# Altium project Main Board.PrjPCB (part 1 of 2)
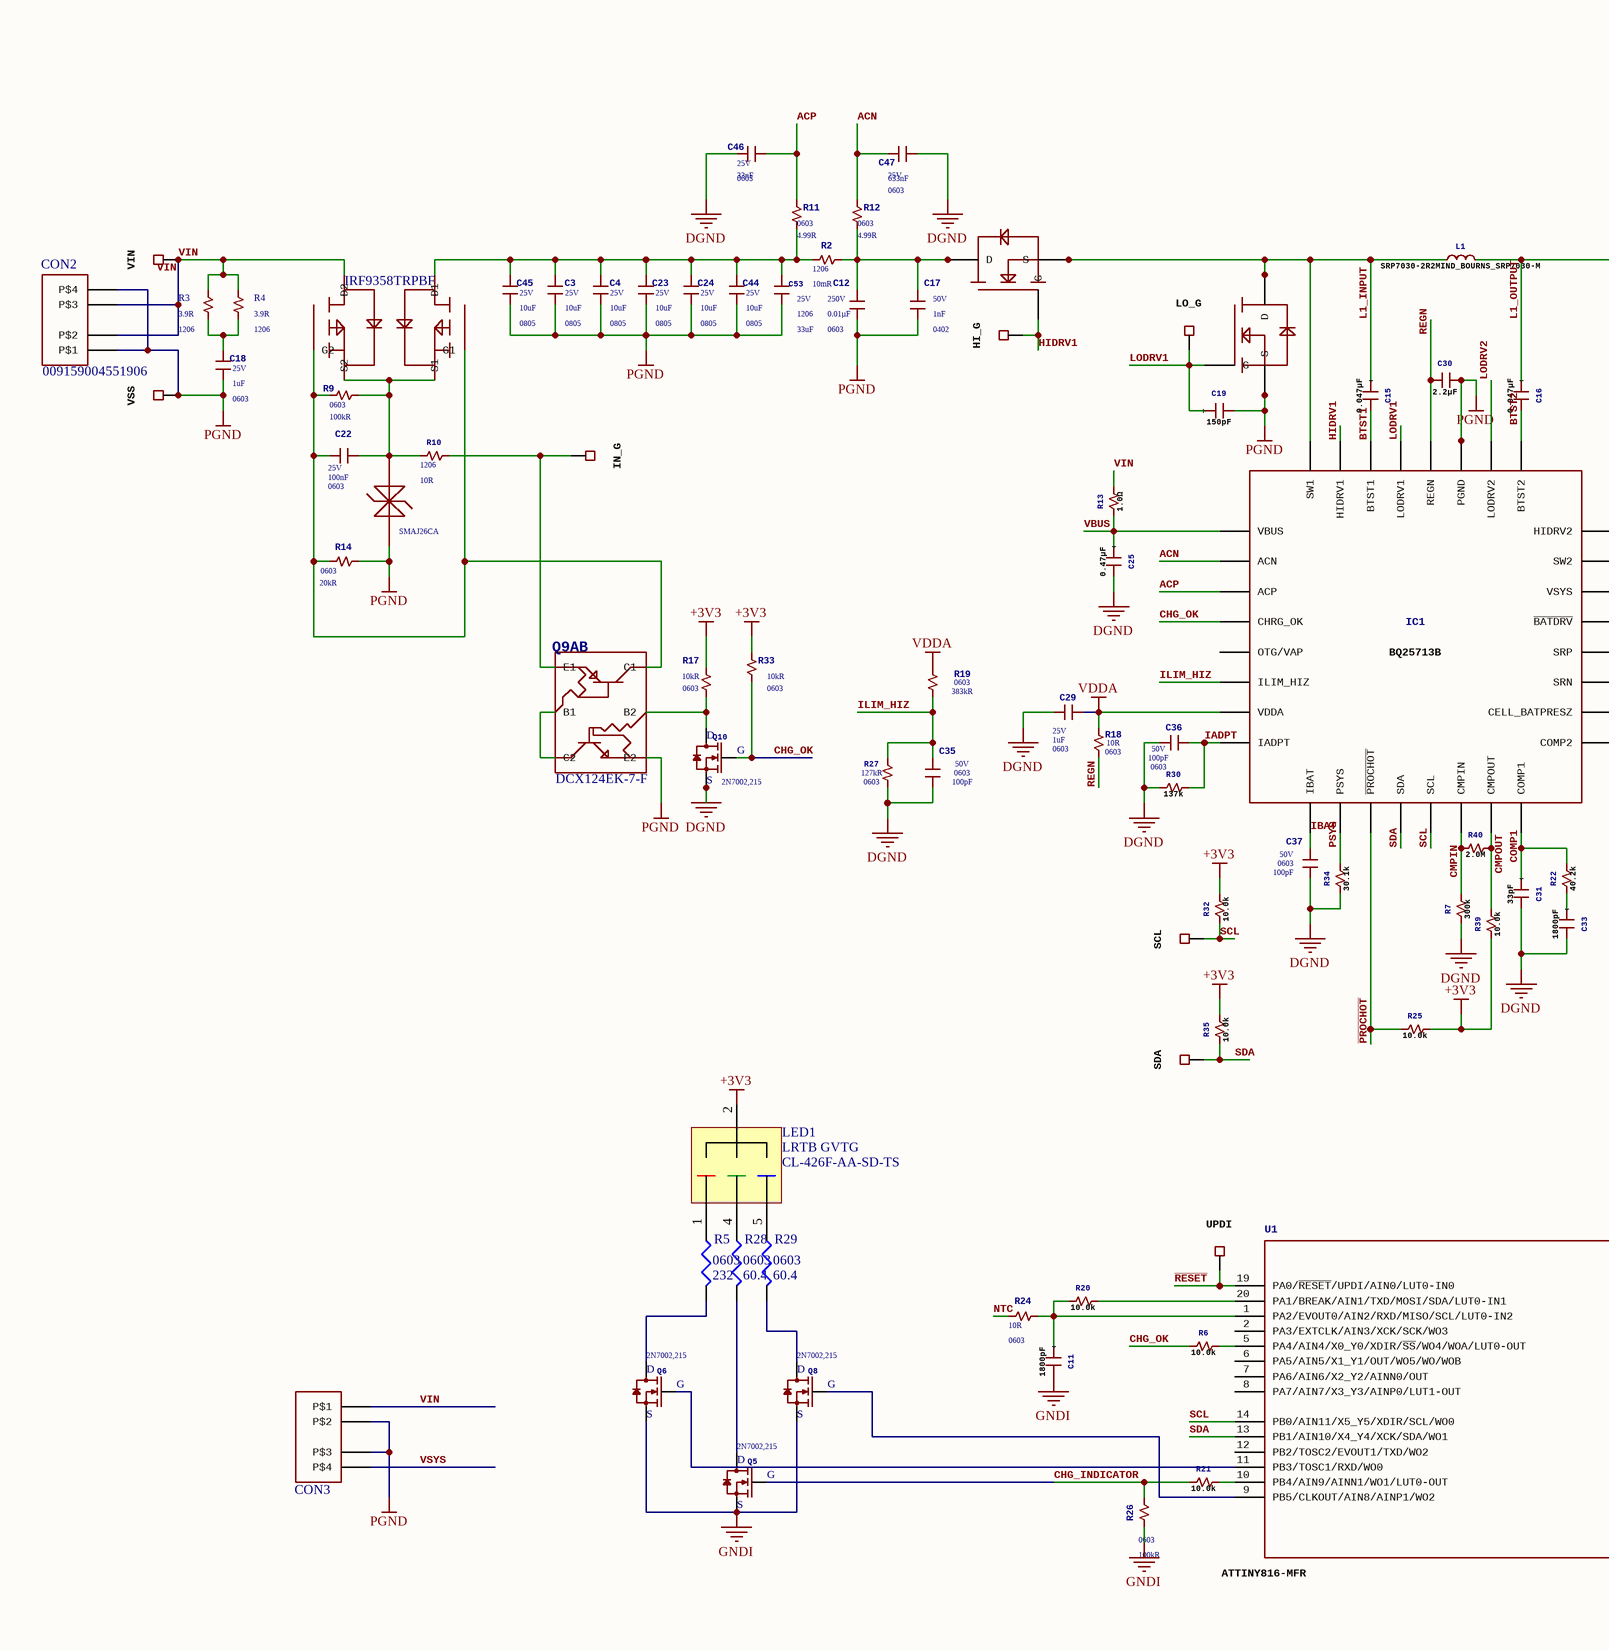
[diagram p0: Main Board.SchDoc, left]
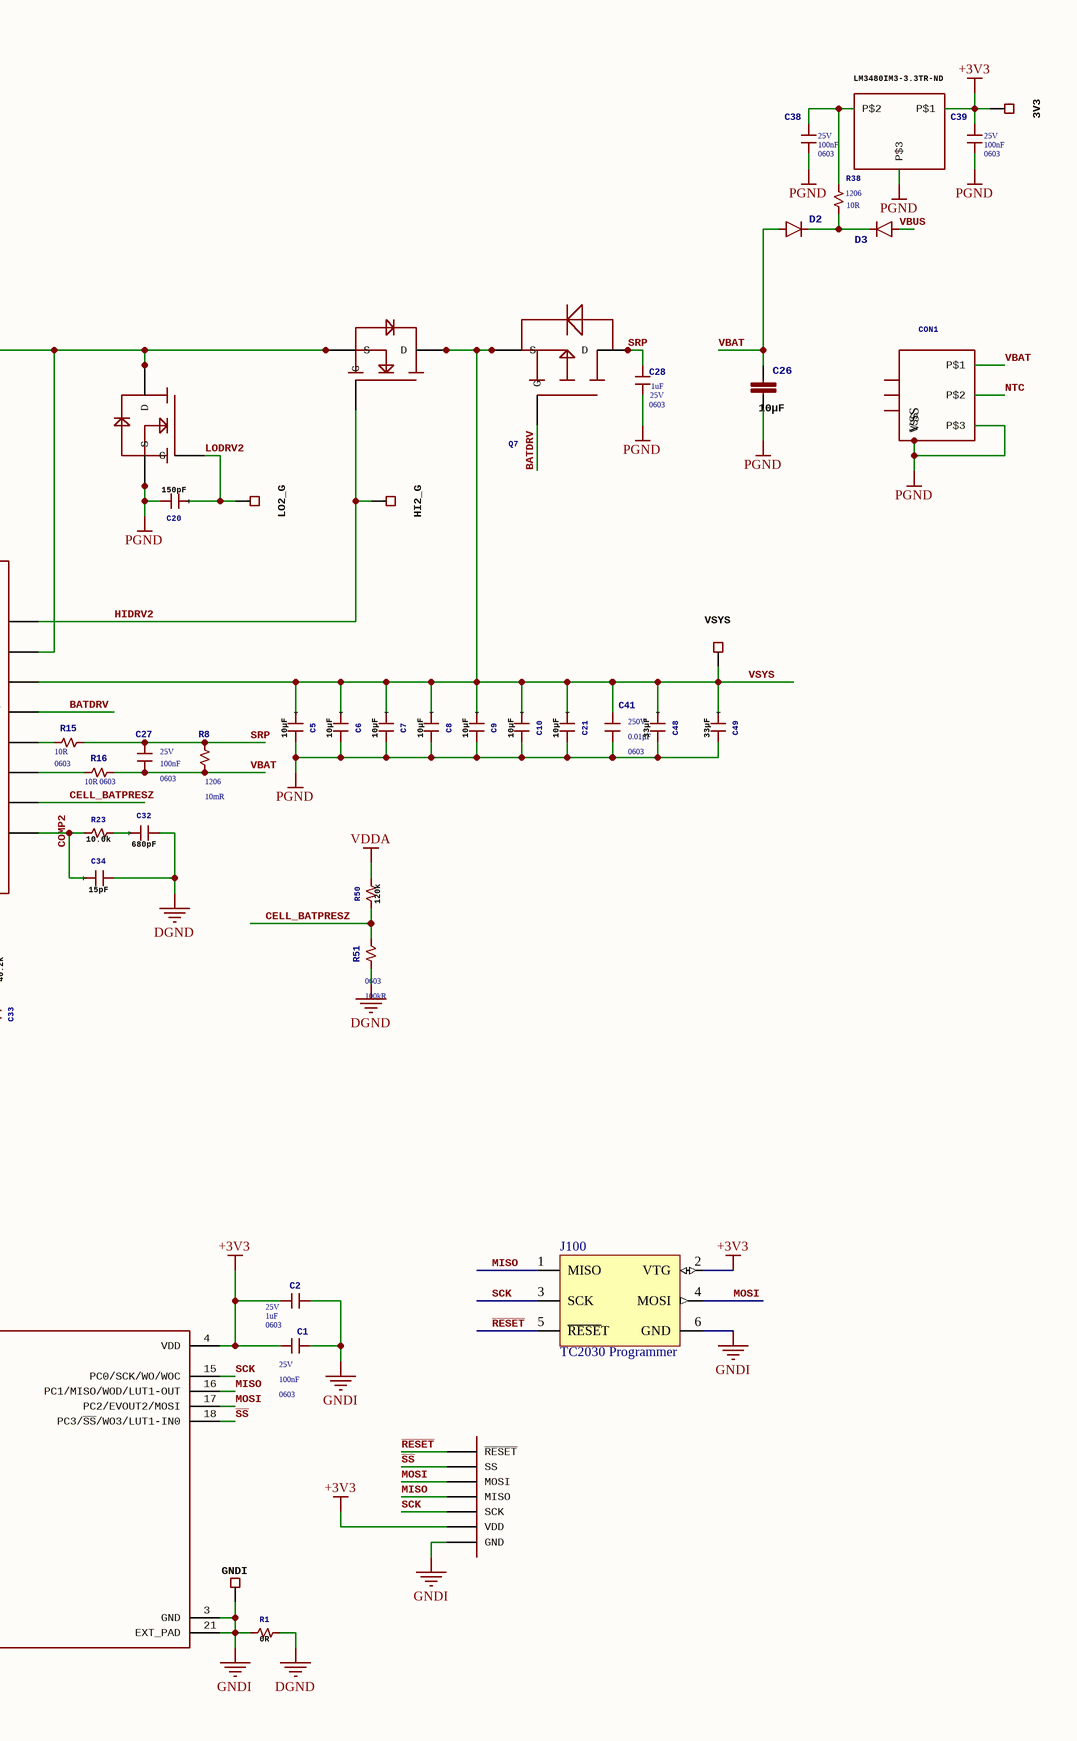
[diagram p1: Main Board.SchDoc, right]
1 sheet, 121 parts. Net scope: global (net labels, ports and power ports of the same name join across sheets).
Board file: Main Board.PcbDoc

## Sheet Main Board.SchDoc
size 456 x 312 mm

### Parts
C1  Voltage Rating: 25V  Capacitance: 100nF  [0603]  (hidden comment: CAP CER 0.1UF 25V X7R 0603)
C2  Voltage: 25V  Capacitance: 1uF  [0603]  (hidden comment: CAP CER 1UF 25V X7R 0603)
C3  Voltage Rating: 25V  Capacitance: 10uF  [0805]  (hidden comment: CAP CER 10UF 25V X5R 0805)
C4  Voltage Rating: 25V  Capacitance: 10uF  [0805]  (hidden comment: CAP CER 10UF 25V X5R 0805)
C5  10µF  [0805]
C6  10µF  [0805]
C7  10µF  [0805]
C8  10µF  [0805]
C9  10µF  [0805]
C10  10µF  [0805]
C11  1800pF  [0402]
C12  Voltage: 250V  Capacitance: 0.01µF  [0603]  (hidden comment: CAP CER 0.01UF 250V X7R 0603)
C15  0.047µF  [0603]
C16  0.047µF  [0603]
C17  Voltage Rating: 50V  Capacitance: 1nF  [0402]  (hidden comment: CAP CER 1000PF 50V C0G/NP0 0402)
C18  Voltage: 25V  Capacitance: 1uF  [0603]  (hidden comment: CAP CER 1UF 25V X7R 0603)
C19  150pF  [0603]
C20  150pF  [0603]
C21  10µF  [0805]
C22  Voltage Rating: 25V  Capacitance: 100nF  [0603]  (hidden comment: CAP CER 0.1UF 25V X7R 0603)
C23  Voltage Rating: 25V  Capacitance: 10uF  [0805]  (hidden comment: CAP CER 10UF 25V X5R 0805)
C24  Voltage Rating: 25V  Capacitance: 10uF  [0805]  (hidden comment: CAP CER 10UF 25V X5R 0805)
C25  0.47µF  [0805]
C26  10µF  [C1206]
C27  Voltage Rating: 25V  Capacitance: 100nF  [0603]  (hidden comment: CAP CER 0.1UF 25V X7R 0603)
C28  Voltage: 25V  Capacitance: 1uF  [0603]  (hidden comment: CAP CER 1UF 25V X7R 0603)
C29  Voltage: 25V  Capacitance: 1uF  [0603]  (hidden comment: CAP CER 1UF 25V X7R 0603)
C30  2.2µF  [0603]
C31  33pF  [0402]
C32  680pF  [0402]
C33  1800pF  [0402]
C34  15pF  [0402]
C35  Voltage: 50V  Capacitance: 100pF  [0603]  (hidden comment: CAP CER 100PF 50V C0G/NP0 0603)
C36  Voltage: 50V  Capacitance: 100pF  [0603]  (hidden comment: CAP CER 100PF 50V C0G/NP0 0603)
C37  Voltage: 50V  Capacitance: 100pF  [0603]  (hidden comment: CAP CER 100PF 50V C0G/NP0 0603)
C38  Voltage Rating: 25V  Capacitance: 100nF  [0603]  (hidden comment: CAP CER 0.1UF 25V X7R 0603)
C39  Voltage Rating: 25V  Capacitance: 100nF  [0603]  (hidden comment: CAP CER 0.1UF 25V X7R 0603)
C41  Voltage: 250V  Capacitance: 0.01µF  [0603]  (hidden comment: CAP CER 0.01UF 250V X7R 0603)
C44  Voltage Rating: 25V  Capacitance: 10uF  [0805]  (hidden comment: CAP CER 10UF 25V X5R 0805)
C45  Voltage Rating: 25V  Capacitance: 10uF  [0805]  (hidden comment: CAP CER 10UF 25V X5R 0805)
C46  Voltage Rating: 25V  Capacitance: 33nF  [0603]  (hidden comment: CAP CER 0.033UF 25V X7R 0603)
C47  Voltage Rating: 25V  Capacitance: 633nF  [0603]  (hidden comment: CAP CER 0.033UF 25V X7R 0603)
C48  33µF  [1206]
C49  33µF  [1206]
C53  Voltage Rating: 25V  Capacitance: 33uF  [1206]  (hidden comment: CAP CER 33UF 25V X5R 1206)
CON1  BM03B-ADHKS-GAN-ETB  [BM03B-ADHKS-GAN-ETB]  (value not drawn)
CON2  009159004551906  [AVX-9159-4-PIN-EDGE]
CON3  AVX-9159-4-PIN-CARD-EDGE  [AVX-9159-4-PIN-EDGE]  (value not drawn)
D1  TVS DIODE 26V 42.1V DO214AC  [DO-214AC]  (value not drawn)
D2  DIODE-SOD323-R  [SOD323-R]  (value not drawn)
D3  DIODE-SOD323-R  [SOD323-R]  (value not drawn)
IC1  BQ25713B  [S-PWQFN-N32]
J100  TC2030 Programmer  [TC2030]  (no BOM)
L1  SRP7030-2R2MIND_BOURNS_SRP7030-M  [IND_BOURNS_SRP7030-M]
LED1  LRTB GVTG  [CL-426F-AA-SD-TS]
PAD1  3V3  [PAD]
PAD2  VIN  [PAD]
PAD3  VSS  [PAD]
PAD4  UPDI  [PAD]
PAD5  SCL  [PAD]
PAD6  SDA  [PAD]
PAD7  VSYS  [PAD]
PAD10  GNDI  [PAD]
PAD11  LO2_G  [PAD]
PAD12  IN_G  [PAD]
PAD13  HI_G  [PAD]
PAD14  LO_G  [PAD]
PAD15  HI2_G  [PAD]
Q1  CSD17551Q3A  [TI-Q3A]  (value not drawn)
Q2  CSD17551Q3A  [TI-Q3A]  (value not drawn)
Q3  CSD17551Q3A  [TI-Q3A]  (value not drawn)
Q4  CSD17551Q3A  [TI-Q3A]  (value not drawn)
Q5  2N7002,215  [SOT-23]
Q5-6  MOSFET 2P-CH 30V 9.2A 8SOIC  [INFENION_SO8]  (value not drawn)
Q6  2N7002,215  [SOT-23]
Q7  CSD25402Q3A  [TI-Q3A]  (value not drawn)
Q8  2N7002,215  [SOT-23]
Q9AB  DCX124EK-7-F  [SC-74R]
Q10  2N7002,215  [SOT-23]
R1  0R  [0402]
R2  Resistance: 10mR  [1206]  (hidden comment: RES 0.01 OHM 1% 1W 1206)
R3  Resistance: 3.9R  [1206]  (hidden comment: RES 3.9 OHM 5% 1/4W 1206)
R4  Resistance: 3.9R  [1206]  (hidden comment: RES 3.9 OHM 5% 1/4W 1206)
R5  Resistance (Ohms): 232  [0603]  (hidden comment: RC0603FR-07232RL)
R6  10.0k  [0402]
R7  300k  [0603]
R8  Resistance: 10mR  [1206]  (hidden comment: RES 0.01 OHM 1% 1W 1206)
R9  Resistance: 100kR  [0603]  (hidden comment: RES SMD 100K OHM 1% 1/10W 0603)
R10  Resistance: 10R  [1206]  (hidden comment: RES SMD 10 OHM 1% 1/2W 1206)
R11  Resistance: 4.99R  [0603]  (hidden comment: RES 4.99 OHM 1% 1/10W 0603)
R12  Resistance: 4.99R  [0603]  (hidden comment: RES 4.99 OHM 1% 1/10W 0603)
R13  1.0Ω  [0805]
R14  Resistance: 20kR  [0603]  (hidden comment: RES 20K OHM 5% 1/10W 0603)
R15  Resistance: 10R  [0603]  (hidden comment: RES SMD 10 OHM 1% 1/10W 0603)
R16  Resistance: 10R  [0603]  (hidden comment: RES SMD 10 OHM 1% 1/10W 0603)
R17  Resistance: 10kR  Case/Package: 0603  [0402]  (hidden comment: RES SMD 10K OHM 1% 1/10W 0603)
R18  Resistance: 10R  [0603]  (hidden comment: RES SMD 10 OHM 1% 1/10W 0603)
R19  Resistance: 383kR  [0603]  (hidden comment: RES SMD 383K OHM 1% 1/10W 0603)
R20  10.0k  [0402]
R21  10.0k  [0402]
R22  40.2k  [0402]
R23  10.0k  [0402]
R24  Resistance: 10R  [0603]  (hidden comment: RES SMD 10 OHM 1% 1/10W 0603)
R25  10.0k  [0603]
R26  Resistance: 100kR  [0603]  (hidden comment: RES SMD 100K OHM 1% 1/10W 0603)
R27  Resistance: 127kR  [0603]  (hidden comment: RES SMD 127K OHM 1% 1/10W 0603)
R28  Resistance (Ohms): 60.4  [0603]  (hidden comment: RC0603FR-0760R4L)
R29  Resistance (Ohms): 60.4  [0603]  (hidden comment: RC0603FR-0760R4L)
R30  137k  [0603]
R32  10.0k  [0603]
R33  Resistance: 10kR  Case/Package: 0603  [0402]  (hidden comment: RES SMD 10K OHM 1% 1/10W 0603)
R34  30.1k  [0603]
R35  10.0k  [0603]
R38  Resistance: 10R  [1206]  (hidden comment: RES SMD 10 OHM 1% 1/2W 1206)
R39  10.0k  [0603]
R40  2.0M  [0603]
R50  120k  [0603]
R51  Resistance: 100kR  [0603]  (hidden comment: RES SMD 100K OHM 1% 1/10W 0603)
U1  ATTINY816-MFR  [QFN40P300X300X90-21N]
U2  LM3480IM3-3.3TR-ND  [SOT-23_2]
U$1  ATTINY_DEBUG  [ATTINY_DEBUG]  (value not drawn)

### Nets
+3V3: C1.P$1 C2.P$2 C39.P$2 J100.2(VTG) LED1.2 PAD1.P$1 R17.P$2 R25.P$2 R32.P$2 R33.P$2 R35.P$2 R39.P$1 U1.4(VDD) U2.P$1 U$1.P$2(VDD)
DGND: C25.P$2 C29.P$1 C31.P$2 C32.P$2 C33.P$2 C34.P$2 C35.P$1 C36.P$1 C37.P$1 C46.P$1 C47.P$2 Q10.2(S) R1.P$2 R7.P$1 R27.P$1 R30.P$1 R34.P$1 R51.P$1
GNDI: C1.P$2 C2.P$1 C11.P$2 J100.6(GND) PAD10.P$1 Q5.2(S) Q6.2(S) Q8.2(S) R1.P$1 R26.P$1 U1.3(GND) U1.21(EXT_PAD) U$1.P$1(GND)
PGND: C3.P$1 C4.P$1 C5.P$2 C6.P$2 C7.P$2 C8.P$2 C9.P$2 C10.P$2 C12.P$1 C17.P$1 C18.P$1 C19.P$2 C20.P$2 C21.P$2 C23.P$1 C24.P$1 C26.2 C28.P$1 C30.P$2 C38.P$1 C39.P$1 C41.P$1 C44.P$1 C45.P$1 C48.P$2 C49.P$2 C53.P$2 CON1.P$3 CON1.P$4(VSS) CON1.P$5(VSS) CON2.P$1 CON2.P$4 CON3.P$2 CON3.P$3 D1.P$2 IC1.P$27(PGND) IC1.P$33(PGND) PAD3.P$1 Q2.P$1(S) Q2.P$2(S) Q2.P$3(S) Q3.P$1(S) Q3.P$2(S) Q3.P$3(S) Q9AB.E2 R14.P$2 U2.P$3
VDDA: C29.P$2 IC1.P$7(VDDA) R18.P$2 R19.P$2 R50.P$2
ACN: C47.P$1 IC1.P$2(ACN) R12.P$2
ACP: C46.P$2 IC1.P$3(ACP) R11.P$2
BATDRV: IC1.P$21(~{BATDRV}) Q7.P$4(G)
BTST1: C15.P$2 IC1.P$30(BTST1)
BTST2: C16.P$2 IC1.P$25(BTST2)
CELL_BATPRESZ: IC1.P$18(CELL_BATPRESZ) R50.P$1 R51.P$2
CHG_INDICATOR: Q5.1(G) R21.P$1 R26.P$2
CHG_OK: IC1.P$4(CHRG_OK) Q10.1(G) R6.P$1 R33.P$1
CMPIN: IC1.P$14(CMPIN) R7.P$2 R40.P$1
CMPOUT: IC1.P$15(CMPOUT) R39.P$2 R40.P$2
COMP1: C31.P$1 IC1.P$16(COMP1) R22.P$2
COMP2: C34.P$1 IC1.P$17(COMP2) R23.P$1
HIDRV1: IC1.P$31(HIDRV1) PAD13.P$1 Q1.P$4(G)
HIDRV2: IC1.P$24(HIDRV2) PAD15.P$1 Q4.P$4(G)
IADPT: C36.P$2 IC1.P$8(IADPT) R30.P$2
IBAT: C37.P$2 IC1.P$9(IBAT)
ILIM_HIZ: C35.P$2 IC1.P$6(ILIM_HIZ) R19.P$1 R27.P$2
L1_INPUT: C15.P$1 IC1.P$32(SW1) L1.1(P$1) Q1.P$1(S) Q1.P$2(S) Q1.P$3(S) Q2.P$5(D) Q2.P$6(D) Q2.P$7(D) Q2.P$8(D) Q2.P$9(D)
L1_OUTPUT: C16.P$1 IC1.P$23(SW2) L1.2(P$2) Q3.P$5(D) Q3.P$6(D) Q3.P$7(D) Q3.P$8(D) Q3.P$9(D) Q4.P$1(S) Q4.P$2(S) Q4.P$3(S)
LODRV1: C19.P$1 IC1.P$29(LODRV1) PAD14.P$1 Q2.P$4(G)
LODRV2: C20.P$1 IC1.P$26(LODRV2) PAD11.P$1 Q3.P$4(G)
MISO: J100.1(MISO) U1.16(PC1/MISO/WOD/LUT1-OUT) U$1.P$4(MISO)
MOSI: J100.4(MOSI) U1.17(PC2/EVOUT2/MOSI) U$1.P$5(MOSI)
NTC: CON1.P$2 R24.P$2
~{PROCHOT}: IC1.P$11(~{PROCHOT}) R25.P$1
PSYS: IC1.P$10(PSYS) R34.P$2
~{RESET}: J100.5(~{RESE}T) PAD4.P$1 U1.19(PA0/~{RESET}/UPDI/AIN0/LUT0-IN0) U$1.P$7(~{RESET})
REGN: C30.P$1 IC1.P$28(REGN) R18.P$1
~{SS}: U1.18(PC3/~{SS}/WO3/LUT1-IN0) U$1.P$6(SS)
SCK: J100.3(SCK) U1.15(PC0/SCK/WO/WOC) U$1.P$3(SCK)
SCL: IC1.P$13(SCL) PAD5.P$1 R32.P$1 U1.14(PB0/AIN11/X5_Y5/XDIR/SCL/WO0)
SDA: IC1.P$12(SDA) PAD6.P$1 R35.P$1 U1.13(PB1/AIN10/X4_Y4/XCK/SDA/WO1)
SRP: C27.P$2 C28.P$2 Q7.P$1(D) Q7.P$2(D) Q7.P$3(D) R8.P$2 R15.P$2
VBAT: C26.1 C27.P$1 CON1.P$1 D2.A R8.P$1 R16.P$2
VBUS: C25.P$1 D3.A IC1.P$1(VBUS) R13.P$1
VIN: CON2.P$2 CON2.P$3 CON3.P$1 PAD2.P$1 Q5-6.P$7_P$8(D2) R3.P$2 R4.P$2 R13.P$2
VSYS: C5.P$1 C6.P$1 C7.P$1 C8.P$1 C9.P$1 C10.P$1 C21.P$1 C41.P$2 C48.P$1 C49.P$1 CON3.P$4 IC1.P$22(VSYS) PAD7.P$1 Q4.P$5(D) Q4.P$6(D) Q4.P$7(D) Q4.P$8(D) Q4.P$9(D) Q7.P$5(S) Q7.P$6(S) Q7.P$7(S) Q7.P$8(S) Q7.P$9(S)
NetC3_P$2: C3.P$2 C4.P$2 C23.P$2 C24.P$2 C44.P$2 C45.P$2 C53.P$1 Q5-6.P$5_P$6(D1) R2.P$1 R11.P$1
NetC11_P$1: C11.P$1 R20.P$1 R24.P$1 U1.1(PA2/EVOUT0/AIN2/RXD/MISO/SCL/LUT0-IN2)
NetC12_P$2: C12.P$2 C17.P$2 Q1.P$5(D) Q1.P$6(D) Q1.P$7(D) Q1.P$8(D) Q1.P$9(D) R2.P$2 R12.P$1
NetC18_P$2: C18.P$2 R3.P$1 R4.P$1
NetC22_P$1: C22.P$1 Q5-6.P$2(G2) Q5-6.P$4(G1) Q9AB.C1 R9.P$1 R14.P$1
NetC22_P$2: C22.P$2 D1.P$1 Q5-6.P$1(S2) Q5-6.P$3(S1) R9.P$2 R10.P$1
NetC32_P$1: C32.P$1 R23.P$2
NetC33_P$1: C33.P$1 R22.P$1
NetC38_P$2: C38.P$2 R38.P$2 U2.P$2
NetD2_C: D2.C D3.C R38.P$1
NetIC1_P$19: IC1.P$19(SRN) R16.P$1
NetIC1_P$20: IC1.P$20(SRP) R15.P$1
NetLED1_1: LED1.1 R5.P$1
NetLED1_4: LED1.4 R28.P$1
NetLED1_5: LED1.5 R29.P$1
NetPAD12_P$1: PAD12.P$1 Q9AB.E1 R10.P$2
NetQ5_3: Q5.3(D) R28.P$2
NetQ6_1: Q6.1(G) U1.11(PB3/TOSC1/RXD/WO0)
NetQ6_3: Q6.3(D) R5.P$2
NetQ8_1: Q8.1(G) U1.9(PB5/CLKOUT/AIN8/AINP1/WO2)
NetQ8_3: Q8.3(D) R29.P$2
NetQ9AB_B1: Q9AB.B1 Q9AB.C2
NetQ9AB_B2: Q9AB.B2 Q10.3(D) R17.P$1
NetR6_P$2: R6.P$2 U1.5(PA4/AIN4/X0_Y0/XDIR/~{SS}/WO4/WOA/LUT0-OUT)
NetR20_P$2: R20.P$2 U1.20(PA1/BREAK/AIN1/TXD/MOSI/SDA/LUT0-IN1)
NetR21_P$2: R21.P$2 U1.10(PB4/AIN9/AINN1/WO1/LUT0-OUT)

Not connected (* = marked no-connect by the designer): IC1 P$5(OTG/VAP); U1 2(PA3/EXTCLK/AIN3/XCK/SCK/WO3) 6(PA5/AIN5/X1_Y1/OUT/WO5/WO/WOB) 7(PA6/AIN6/X2_Y2/AINN0/OUT) 8(PA7/AIN7/X3_Y3/AINP0/LUT1-OUT) 12(PB2/TOSC2/EVOUT1/TXD/WO2)